# Altium schematic sheet Rat.SchDoc
size A
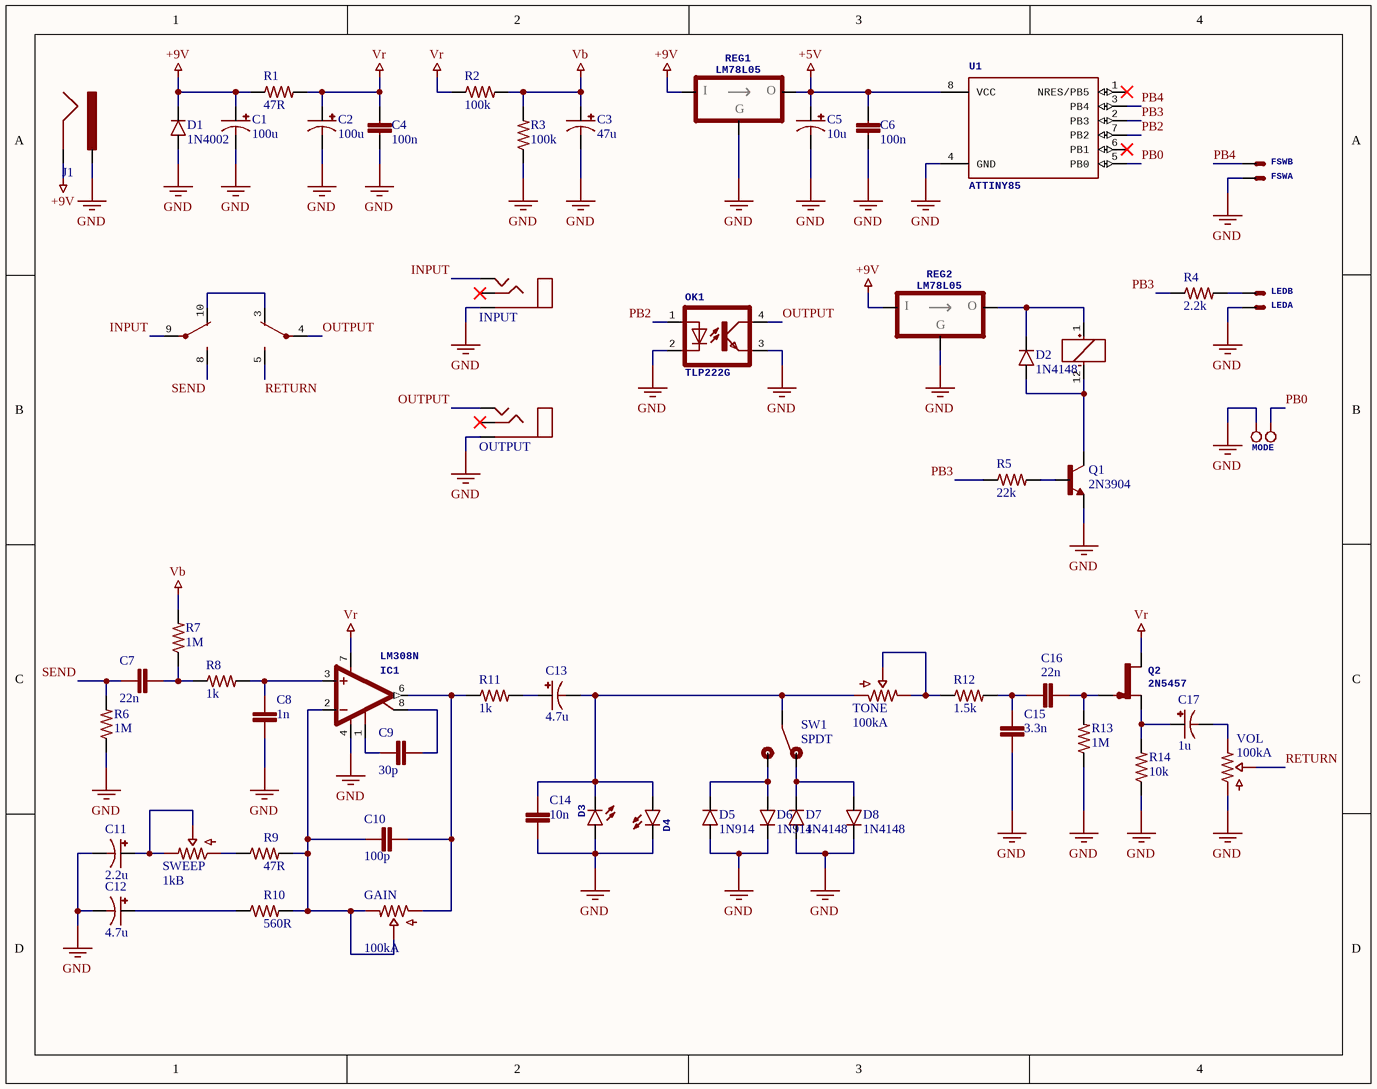
[diagram p0: Rat.SchDoc]

## Parts
C1  100u  [ELEC_050_020]
C2  100u  [ELEC_050_020]
C3  47u  [ELEC_050_020]
C4  100n  [CER_050]
C5  10u  [ELEC_040_020]
C6  100n  [CER_050]
C7  22n  [FILMBOX_SMALL]
C8  1n  [FILMBOX_SMALL]
C9  30p  [CER_050]
C10  100p  [CER_050]
C11  2.2u  [ELEC_LESR_050_020]
C12  4.7u  [ELEC_LESR_050_020]
C13  4.7u  [ELEC_LESR_050_020]
C14  10n  [FILMBOX_SMALL]
C15  3.3n  [FILMBOX_SMALL]
C16  22n  [FILMBOX_SMALL]
C17  1u  [ELEC_LESR_040_020]
D1  1N4002  [DO41_2]
D2  1N4148  [DO35_2]
D3  LED  [LED_3MM]  (value not drawn)
D4  LED  [LED_3MM]  (value not drawn)
D5  1N914  [DO35_3]
D6  1N914  [DO35_3]
D7  1N4148  [DO35_2]
D8  1N4148  [DO35_2]
FSW  JST-XH-02  [JST-XH-02]  (value not drawn)  (parts A,B of 2)
GAIN  100kA  [ALPHA_16mm_BOTTOM]
IC1  LM308N  [DIL8]
INPUT  STEREO  [STEREO]  (value not drawn)
J1  DC_JACK  [DC_JACK]  (value not drawn)
K1  NA5W-K  [NA5]  (value not drawn)  (parts A,B,C of 3)
LED  JST-XH-02  [JST-XH-02]  (value not drawn)  (parts A,B of 2)
MODE  HEADER_2PINS  [HEADER_2PINS]  (value not drawn)
OK1  TLP222G  [DIL4]
OUTPUT  STEREO  [STEREO]  (value not drawn)
Q1  2N3904  [TO92]
Q2  2N5457  [TO92]
R1  47R  [R_3_47R_025W]
R2  100k  [R_3_100k_025W]
R3  100k  [R_3_100k_025W]
R4  2.2k  [R_3_2,2k_025W]
R5  22k  [R_3_22k_025W]
R6  1M  [R_3_1M_025W]
R7  1M  [R_3_1M_025W]
R8  1k  [R_3_1k_025W]
R9  47R  [R_3_47R_025W]
R10  560R  [R_3_560R_025W]
R11  1k  [R_3_1k_025W]
R12  1.5k  [R_3_1.5k_025W]
R13  1M  [R_3_1M_025W]
R14  10k  [R_3_10k_025W]
REG1  LM78L05  [TO92]
REG2  LM78L05  [TO92]
SW1  SPDT  [SPDT]
SWEEP  1kB  [ALPHA_16mm_BOTTOM]
TONE  100kA  [ALPHA_16mm_BOTTOM]
U1  ATTINY85  [DIP8]
VOL  100kA  [ALPHA_16mm_BOTTOM]

## Nets
+5V: C5.+ C6.2 REG1.3(VO) U1.8(VCC)
+9V: C1.+ D1.C J1.GND R1.1 REG1.1(VI) REG2.1(VI)
GND: C1.- C2.- C3.- C4.2 C5.- C6.1 C8.2 C11.- C12.- C14.2 C15.2 D1.A D3.ANODE(A) D4.P$1(C) D5.A D6.C D7.A D8.C FSW.2(S) IC1.4(V-) INPUT.S J1.PWR LED.2(S) MODE.1 OK1.2(C) OK1.3(EMIT) OUTPUT.S Q1.3(E) R3.1 R6.1 R13.1 R14.1 REG1.2(GND) REG2.2(GND) U1.4(GND) VOL.1
Vb: C3.+ R2.2 R3.2 R7.2
Vr: C2.+ C4.1 IC1.7(V+) Q2.3(D) R1.2 R2.1
INPUT: INPUT.T K1.9(P)
OUTPUT: K1.4(P) OK1.4(COL) OUTPUT.T
PB0: MODE.2 U1.5(PB0)
PB2: OK1.1(A) U1.7(PB2)
PB3: R4.1 R5.1 U1.2(PB3)
PB4: FSW.1(S) U1.3(PB4)
RETURN: K1.5(S) VOL.2
SEND: C7.2 K1.8(S) R6.2
NetC7_1: C7.1 R7.1 R8.1
NetC8_1: C8.1 IC1.3(+IN) R8.2
NetC9_1: C9.1 IC1.8(CMP2)
NetC9_2: C9.2 IC1.1(CMP1)
NetC10_1: C10.1 GAIN.1 IC1.6(OUT) R11.1
NetC10_2: C10.2 GAIN.2 GAIN.3 IC1.2(-IN) R9.2 R10.2
NetC11_+: C11.+ SWEEP.2 SWEEP.3
NetC12_+: C12.+ R10.1
NetC13_+: C13.+ R11.2
NetC13_-: C13.- C14.1 D3.P$1(C) D4.ANODE(A) SW1.2(P) TONE.1
NetC15_1: C15.1 C16.2 R12.2
NetC16_1: C16.1 Q2.1(G) R13.2
NetC17_+: C17.+ Q2.2(S) R14.2
NetC17_-: C17.- VOL.3
NetD2_A: D2.A K1.12(-) Q1.1(C)
NetD2_C: D2.C K1.1(+) REG2.3(VO)
NetD5_C: D5.C D6.A SW1.3(S)
NetD7_C: D7.C D8.A SW1.1(O)
NetK1_3: K1.3(O) K1.10(O)
NetLED_1: LED.1(S) R4.2
NetQ1_2: Q1.2(B) R5.2
NetR9_1: R9.1 SWEEP.1
NetR12_1: R12.1 TONE.2 TONE.3

Not connected (* = marked no-connect by the designer): INPUT R*; OUTPUT R*; U1 1(NRES/PB5)* 6(PB1)*

## Notes on the sheet
- (in symbol LM78L05) I; O; G

## Library data of the parts
C1 C2 = ELEC_100u_16V: 100u 16V electrolytic capacitor; PinSpacing: 2mm; Price: 0.02; Dimensions: 5x8mm; Package: Radial
C3 = ELEC_47u_25V: 47u 25V electrolytic capacitor; PinSpacing: 2mm; Price: 0.02; Dimensions: 5x8mm; Package: Radial
C4 C6 = CER_100n: 100n MLCC X7R radial capacitor; PinSpacing: 5.08mm; Price: 0.02; Package: Radial
C5 = ELEC_10u_50V: 10u 50V electrolytic capacitor; PinSpacing: 2mm; Price: 0.02; Dimensions: 4x8mm; Package: Radial
C7 C16 = FILMBOX_22n: 22n 100V polyester film box capacitor; PinSpacing: 5.08mm; Price: 0.05; Dimensions: 7.2x2.5x6.5mm; Package: Radial
C8 = FILMBOX_1n: 1n 100V polyester film box capacitor; PinSpacing: 5.08mm; Price: 0.05; Dimensions: 7.2x2.5x6.5mm; Package: Radial
C9 = CER_30p: 30p MLCC X7R radial capacitor; PinSpacing: 5.08mm; Price: 0.01; Package: Radial
C10 = CER_100p: 100p MLCC X7R radial capacitor; PinSpacing: 5.08mm; Price: 0.01; Package: Radial
C11 = ELEC_LESR_2.2u_50V: 2.2u 50V Low ESR ectrolytic capacitor; PinSpacing: 2mm; Price: 0.05; Dimensions: 5x11mm; Package: Radial
C12 C13 = ELEC_LESR_4.7u_50V: 4.7u 50V Low ESR ectrolytic capacitor; PinSpacing: 2mm; Price: 0.05; Dimensions: 5x11mm; Package: Radial
C14 = FILMBOX_10n: 10n 100V polyester film box capacitor; PinSpacing: 5.08mm; Price: 0.05; Dimensions: 7.2x2.5x6.5mm; Package: Radial
C15 = FILMBOX_3.3n: 3.3n 100V polyester film box capacitor; PinSpacing: 5.08mm; Price: 0.05; Dimensions: 7.2x2.5x6.5mm; Package: Radial
C17 = ELEC_LESR_1u_50V: 1u 50V Low ESR electrolytic capacitor; PinSpacing: 2mm; Price: 0.05; Dimensions: 4x8mm; Package: Radial
D1 = 1N4002: PinSpacing: 7.62mm; Price: 0.01; Package: DO-41
D2 D7 D8 = 1N4148: PinSpacing: 5.08mm; Price: 0.01; Package: DO-35
D3 D4 = LED: 3mm LED; Price: 0.01; Dimensions: 3mm; Package: T1
D5 D6 = 1N914: PinSpacing: 7.62mm; Price: 0.03; Package: DO-35
FSW LED = JST-XH-02: 2 Pins male XH header; Price: 0.1
GAIN TONE VOL = 100kA_ALPHA_16mm: 100k Log potentiometer round shaft; Price: 0.5; Dimensions: 16mm; Package: PCB Mounted
INPUT OUTPUT = STEREO: 6.35mm stereo insulated socket jack PCB mounted; Price: 0.5
J1 = DC_JACK: DC Power jack 2.1mm barrel; Price: 0.05
MODE = HEADER_2PINS: 2 Pins male header; Pin spacing: 2.54mm; Price: 0.01
R1 R9 = R_3_47R_025W: 47R metal film 1/4W Resistor; PinSpacing: 7.62mm; Price: 0.01
R2 R3 = R_3_100k_025W: 100k metal film 1/4W Resistor; PinSpacing: 7.62mm; Price: 0.01
R4 = R_3_2.2k_025W: 2.2k metal film 1/4W Resistor; PinSpacing: 7.62mm; Price: 0.01
R5 = R_3_22k_025W: 22k metal film 1/4W Resistor; PinSpacing: 7.62mm; Price: 0.01
R6 R7 R13 = R_3_1M_025W: 1M metal film 1/4W Resistor; PinSpacing: 7.62mm; Price: 0.01
R8 R11 = R_3_1k_025W: 1k metal film 1/4W Resistor; PinSpacing: 7.62mm; Price: 0.01
R10 = R_3_560R_025W: 560R metal film 1/4W Resistor; PinSpacing: 7.62mm; Price: 0.01
R12 = R_3_1.5k_025W: 1.5k metal film 1/4W Resistor; PinSpacing: 7.62mm; Price: 0.01
R14 = R_3_10k_025W: 10k metal film 1/4W Resistor; PinSpacing: 7.62mm; Price: 0.01
REG1 REG2 = LM78L05: 78L05; Price: 0.01; Package: TO-92
SW1 = SPDT_ON-OFF-ON: SPDT toggle switch ON/OFF/ON; Price: 0.5
SWEEP = 1kB_ALPHA_16mm: 1k Lin potentiometer round shaft; Price: 0.5; Dimensions: 16mm; Package: PCB Mounted
U1 = ATTINY85: ATTINY85-20PU; Price: 1.2; Package: DIP-8
IC1 = LM308N: Package: DIP-8; Price: 0.3
K1 = NA5W-K: Price: 1.1
OK1 = TLP222G: Price: 0.36
Q1 = 2N3904: Price: 0.01; Package: TO-92
Q2 = 2N5457: Price: 0.2; Package: TO-92